# EAGLE schematic day0_Abdul Gani_18315033.sch (EAGLE 7.4.0)
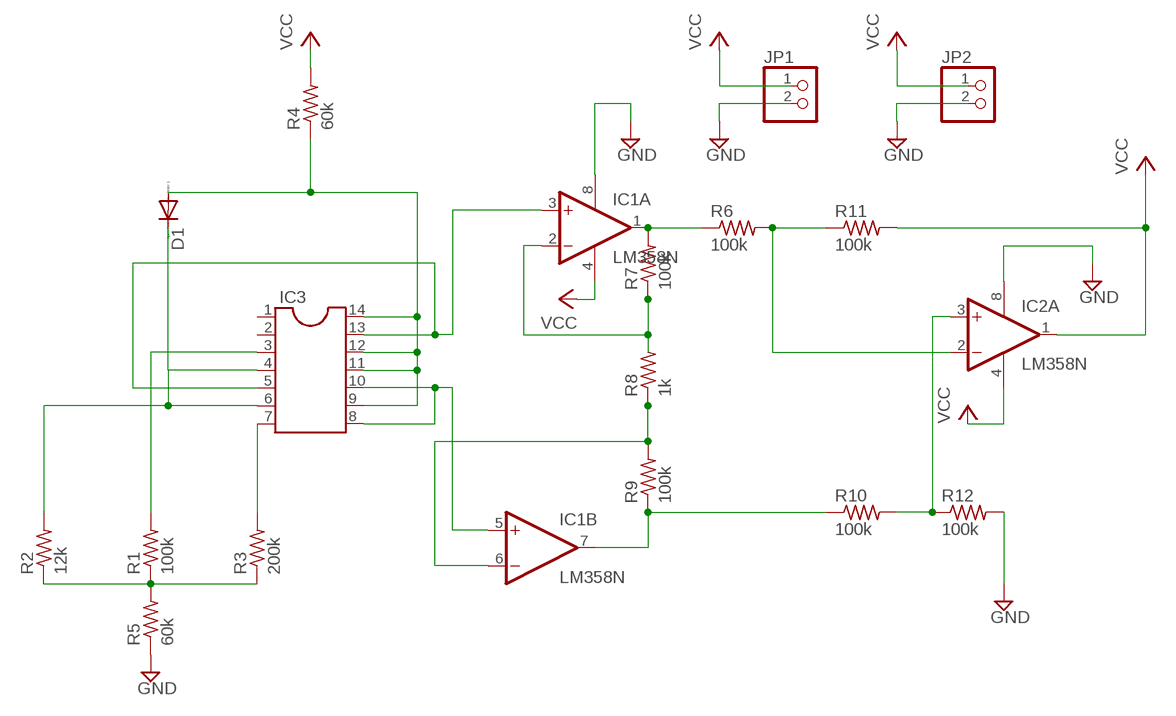
[diagram p0: schematic, sheet 1]

## Parts
D1  DIODE-D-7.5  [D-7.5]
IC1  LM358N  [DIL08]
IC2  LM358N  [DIL08]
IC3  DIL14  [DIL14]
JP1  PINHD-1X2  [1X02]
JP2  PINHD-1X2  [1X02]
R1  100k  R-US_0204/7  [0204/7]
R2  12k  R-US_0204/7  [0204/7]
R3  200k  R-US_0204/7  [0204/7]
R4  60k  R-US_0204/7  [0204/7]
R5  60k  R-US_0204/7  [0204/7]
R6  100k  R-US_0204/7  [0204/7]
R7  100k  R-US_0204/7  [0204/7]
R8  1k  R-US_0204/7  [0204/7]
R9  100k  R-US_0204/7  [0204/7]
R10  100k  R-US_0204/7  [0204/7]
R11  100k  R-US_0204/7  [0204/7]
R12  100k  R-US_0204/7  [0204/7]

## Nets
GND: IC1.8(P:V+) IC2.8(P:V+) JP1.2 JP2.2 R5.1 R12.2
N$1: R1.1 R2.1 R3.1 R5.2
N$2: R7.1 R8.2
N$3: IC1.6(B:-IN) R8.1 R9.2
N$4: IC1.1(A:OUT) R6.1 R7.2
N$5: D1.C IC3.4 IC3.6 R2.2
N$6: IC3.7 R3.2
N$7: IC3.3 R1.2
N$9: D1.A IC3.9 IC3.11 IC3.12 IC3.14 R4.1
N$10: IC1.5(B:+IN) IC3.8 IC3.10
N$11: IC1.3(A:+IN) IC3.5 IC3.13
N$15: IC1.7(B:OUT) R9.1 R10.1
N$16: IC2.2(A:-IN) R6.2 R11.1
N$17: IC2.3(A:+IN) R10.2 R12.1
N$18: IC1.2(A:-IN)
VCC: IC1.4(P:V-) IC2.1(A:OUT) IC2.4(P:V-) JP1.1 JP2.1 R4.2 R11.2
Unconnected: IC2.5(B:+IN) IC2.6(B:-IN) IC2.7(B:OUT) IC3.1 IC3.2

## Library data of the parts
D1 = diode:DIODE-: DIODE
IC1 IC2 = linear:LM358: OP AMP also LM158; LM258; LM2904 Source: http://cache.national.com/ds/LM/LM158.pdf
IC3 = ic-package:DIL14: Dual In Line / Socket
JP1 JP2 = pinhead:PINHD-1X2: PIN HEADER
R1-R12 = rcl:R-US_: RESISTOR, American symbol